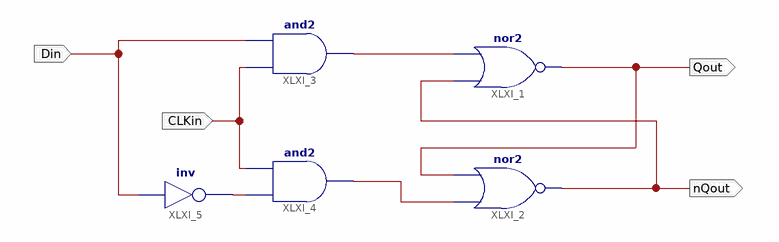
[diagram p0: schematic sheet 1]
// Xilinx ISE schematic NORdff.sch (spartan3e) as structural Verilog: 5 symbols, 4 ports
module NORdff (
  input  CLKin,
  input  Din,
  output Qout,
  output nQout
);

  wire XLXN_4, XLXN_5, XLXN_12;

  nor XLXI_1 (Qout, nQout, XLXN_4);
  nor XLXI_2 (nQout, XLXN_5, Qout);
  and XLXI_3 (XLXN_4, CLKin, Din);
  and XLXI_4 (XLXN_5, XLXN_12, CLKin);
  not XLXI_5 (XLXN_12, Din);
endmodule
